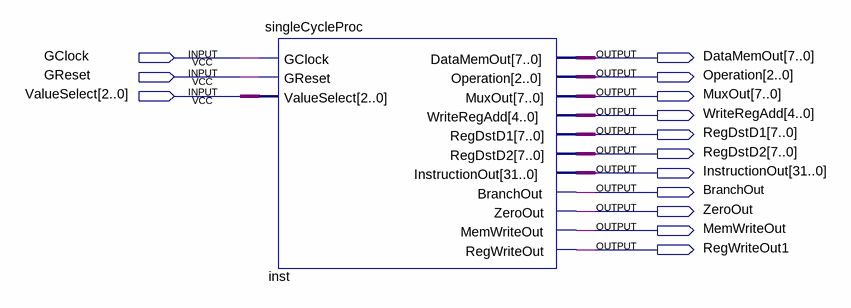
[diagram p0: schematic sheet]
// Quartus schematic topLevel.bdf as structural Verilog: 1 symbols, 14 pins
module topLevel (
  input  GClock,
  input  GReset,
  input  [2:0] ValueSelect,
  output [7:0] DataMemOut,
  output [2:0] Operation,
  output [7:0] MuxOut,
  output [4:0] WriteRegAdd,
  output [7:0] RegDstD1,
  output [7:0] RegDstD2,
  output [31:0] InstructionOut,
  output BranchOut,
  output ZeroOut,
  output MemWriteOut,
  output RegWriteOut1
);

  singleCycleProc inst (
    .GClock(GClock), .GReset(GReset), .ValueSelect(ValueSelect), .DataMemOut(DataMemOut),
    .Operation(Operation), .MuxOut(MuxOut), .WriteRegAdd(WriteRegAdd), .RegDstD1(RegDstD1),
    .RegDstD2(RegDstD2), .InstructionOut(InstructionOut), .BranchOut(BranchOut), .ZeroOut(ZeroOut),
    .MemWriteOut(MemWriteOut), .RegWriteOut(RegWriteOut1));
endmodule
